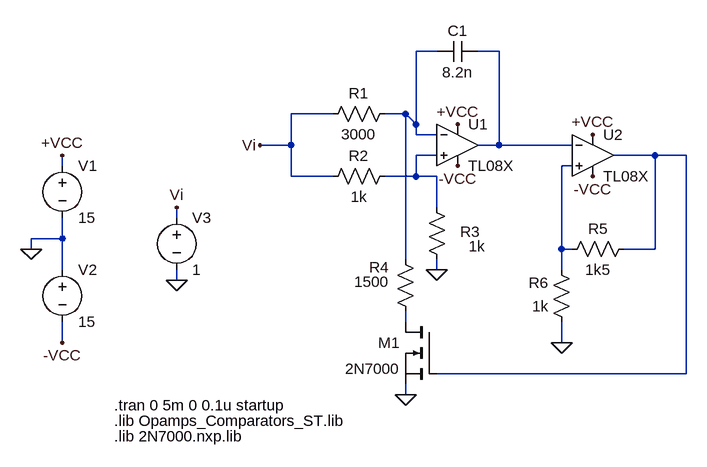
[diagram p0: schematic VCO.asc]
VCO.asc, the LTspice schematic file:
Version 4
SHEET 1 900 680
WIRE -192 -128 -224 -128
WIRE -96 -128 -128 -128
WIRE -352 -32 -416 -32
WIRE -240 -32 -272 -32
WIRE -224 -16 -224 -128
WIRE -224 -16 -240 -32
WIRE -224 0 -224 -16
WIRE -192 0 -224 0
WIRE -416 16 -416 -32
WIRE -416 16 -464 16
WIRE -96 16 -96 -128
WIRE -96 16 -128 16
WIRE 16 16 -96 16
WIRE -192 32 -224 32
WIRE 144 32 80 32
WIRE 192 32 144 32
WIRE -768 48 -768 32
WIRE 16 48 0 48
WIRE -416 64 -416 16
WIRE -352 64 -416 64
WIRE -224 64 -224 32
WIRE -224 64 -272 64
WIRE -192 64 -224 64
WIRE -192 112 -192 64
WIRE -592 128 -592 112
WIRE -768 160 -768 128
WIRE -768 160 -816 160
WIRE -816 176 -816 160
WIRE 0 176 0 48
WIRE 16 176 0 176
WIRE 144 176 144 32
WIRE 144 176 96 176
WIRE -240 192 -240 -32
WIRE -768 208 -768 160
WIRE -192 208 -192 192
WIRE 0 208 0 176
WIRE -592 224 -592 208
WIRE -240 288 -240 272
WIRE -768 320 -768 288
WIRE 0 320 0 288
WIRE 192 368 192 32
WIRE 192 368 -192 368
WIRE -240 400 -240 384
FLAG -816 176 0
FLAG -768 32 +VCC
FLAG -768 320 -VCC
FLAG -160 48 -VCC
FLAG -160 -16 +VCC
FLAG -192 208 0
FLAG -240 400 0
FLAG 48 64 -VCC
FLAG 48 0 +VCC
FLAG -592 224 0
FLAG -592 112 Vi
FLAG 0 320 0
FLAG -464 16 Vi
SYMBOL Opamps\\opamp2 -160 -48 R0
SYMATTR InstName U1
SYMATTR Value TL08X
SYMBOL res -256 -48 R90
WINDOW 0 0 56 VBottom 2
WINDOW 3 32 56 VTop 2
SYMATTR InstName R1
SYMATTR Value 3000
SYMBOL res -256 48 R90
WINDOW 0 0 56 VBottom 2
WINDOW 3 32 56 VTop 2
SYMATTR InstName R2
SYMATTR Value 1k
SYMBOL res -176 208 R180
WINDOW 0 -51 59 Left 2
WINDOW 3 -59 36 Left 2
SYMATTR InstName R3
SYMATTR Value 1k
SYMBOL voltage -768 32 R0
WINDOW 123 0 0 Left 0
WINDOW 39 0 0 Left 0
SYMATTR InstName V1
SYMATTR Value 15
SYMBOL voltage -768 192 R0
WINDOW 123 0 0 Left 0
WINDOW 39 0 0 Left 0
SYMATTR InstName V2
SYMATTR Value 15
SYMBOL nmos -192 288 M0
SYMATTR InstName M1
SYMATTR Value 2N7000
SYMATTR Prefix X
SYMBOL res -256 176 R0
WINDOW 0 -40 28 Left 2
WINDOW 3 -63 50 Left 2
SYMATTR InstName R4
SYMATTR Value 1500
SYMBOL cap -128 -144 R90
WINDOW 0 0 32 VBottom 2
WINDOW 3 32 32 VTop 2
SYMATTR InstName C1
SYMATTR Value 8.2n
SYMBOL Opamps\\opamp2 48 -32 R0
SYMATTR InstName U2
SYMATTR Value TL08X
SYMBOL res 112 160 R90
WINDOW 0 0 56 VBottom 2
WINDOW 3 32 56 VTop 2
SYMATTR InstName R5
SYMATTR Value 1k5
SYMBOL res 16 304 R180
WINDOW 0 36 76 Left 2
WINDOW 3 36 40 Left 2
SYMATTR InstName R6
SYMATTR Value 1k
SYMBOL voltage -592 112 R0
WINDOW 123 0 0 Left 0
WINDOW 39 0 0 Left 0
SYMATTR InstName V3
SYMATTR Value 1
TEXT -688 416 Left 2 !.tran 0 5m 0 0.1u startup
TEXT -688 440 Left 2 !.lib Opamps_Comparators_ST.lib
TEXT -688 464 Left 2 !.lib 2N7000.nxp.lib

The netlist it stands for:
* VCO.asc
XU1 N003 N001 +VCC -VCC N002 TL08X  ; pins In+ In- V+ V- OUT
R1 N001 Vi 3000
R2 N003 Vi 1k
R3 0 N003 1k
V1 +VCC 0 15
V2 0 -VCC 15
XM1 N006 N004 0 2N7000  ; pins D G S
R4 N001 N006 1500
C1 N002 N001 8.2n
XU2 N005 N002 +VCC -VCC N004 TL08X  ; pins In+ In- V+ V- OUT
R5 N004 N005 1k5
R6 0 N005 1k
V3 Vi 0 1
.tran 0 5m 0 0.1u startup
.lib Opamps_Comparators_ST.lib
.lib 2N7000.nxp.lib
.backanno
.end